# Altium schematic sheet lora.SchDoc
size A4; SheetNumber: 4; SheetTotal: 6
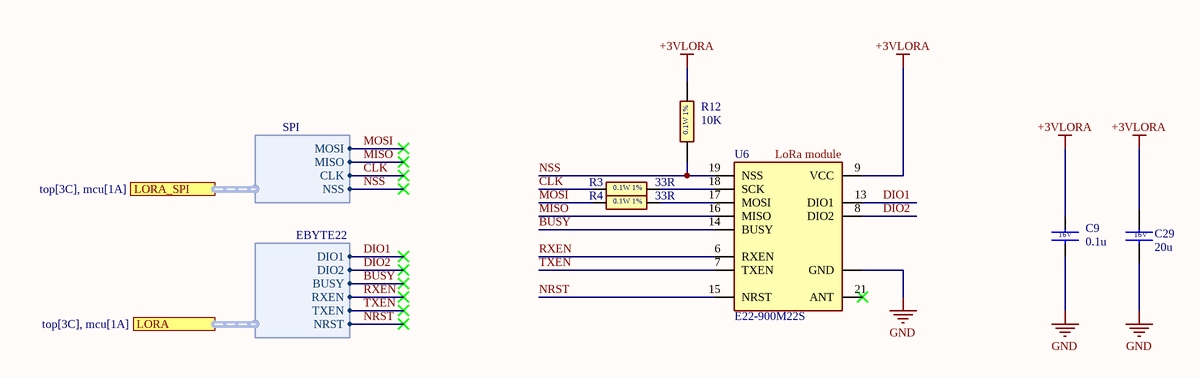
[diagram p0: lora.SchDoc]

## Parts
C9  0.1u  [CAPC1608X95N]
C29  20u  [C0603]
R3  33R  [RESC1608X55N]
R4  33R  [RESC1608X55N]
R12  10K  [RESC1608X50N]
U6  E22-900M22S  [E22-900M22S]

## Ports
LORA (harness EBYTE22, see top[3C], mcu[1A]), LORA_SPI (harness SPI, see top[3C], mcu[1A])

## Harnesses
SPI: MOSI, MISO, CLK, NSS
EBYTE22: BUSY, RXEN, TXEN, NRST, DIO2, DIO1

## Nets
+3VLORA: C9.1 C29.1 R12.2 U6.9(VCC)
GND: C9.2 C29.2 U6.1(GND)
BUSY: U6.14(BUSY) ; port LORA.BUSY
CLK: R3.1 ; port LORA_SPI.CLK
DIO1: U6.13(DIO1) ; port LORA.DIO1
DIO2: U6.8(DIO2) ; port LORA.DIO2
MISO: U6.16(MISO) ; port LORA_SPI.MISO
MOSI: R4.1 ; port LORA_SPI.MOSI
NRST: U6.15(NRST) ; port LORA.NRST
NSS: R12.1 U6.19(NSS) ; port LORA_SPI.NSS
RXEN: U6.6(RXEN) ; port LORA.RXEN
TXEN: U6.7(TXEN) ; port LORA.TXEN
NetR3_2: R3.2 U6.18(SCK)
NetR4_2: R4.2 U6.17(MOSI)

Not connected (* = marked no-connect by the designer): U6 21(ANT)*

## Notes on the sheet
- (near U6) LoRa module
- Název výkresu /drawing title/:
- Název souboru /sheet name/:
- Varianta /variant/:
- Organizace /organisation/:
- ČVUT FEL
- Kreslil /drawn by/:
- Datum /date/:
- Podpis /signature/:
- List /sheet/:
- Verze /version/:
- /
- (in symbol ECK+20u16V) 16V
- (in symbol ECK+100n16V) 16V
- (in symbol ER+10K) 0.1W 1%
- (in symbol ER+33R) 0.1W 1%

## Library data of the parts
C9 = ECK+100n16V: 16V 0.1uF XR7 0603 10%; Manufacturer_Name: KEMET; Manufacturer_Part_Number: C0603C104K4RAC-TU; Datasheet Link: https://connect.kemet.com:7667/gateway/IntelliData-ComponentDocumentation/1.0/download/specsheet/C0603C104K4RACTU; Height: 0.95mm; Mouser Part Number: 80-C0603C104K4RAC; Arrow Part Number: C0603C104K4RAC-TU; Arrow Price/Stock: https://www.arrow.com/en/products/c0603c104k4ractu/kemet-corporation
C29 = ECK+20u16V: Capacitor; Manufacturer_Name: Yageo Group; Manufacturer_Part_Number: C0603C200K4HACAUTO; Datasheet Link: https://www.yageogroup.com/content/datasheet/asset/file/KEM_C1007_X8R_ULTRA_150C_SMD; Height: 0.87mm; Mouser Part Number: 80-C0603C200K4HAUTO; Mouser Price/Stock: https://www.mouser.co.uk/ProductDetail/KEMET/C0603C200K4HACAUTO?qs=j%252B1pi9TdxUZOUXgrptGPiw%3D%3D; Arrow Part Number: C0603C200K4HACAUTO; Arrow Price/Stock: https://www.arrow.com/en/products/c0603c200k4hacauto/kemet-corporation?utm_currency=USD&region=nac
R3 R4 = ER+33R: Resistor 1% 0.1W; Manufacturer_Name: ROYALOHM; Manufacturer_Part_Number: 0603WAF330JT5E; Datasheet Link: https://datasheet.lcsc.com/lcsc/2206010116_UNI-ROYAL-Uniroyal-Elec-0603WAF330JT5E_C23140.pdf; Height: 0.55mm; Mouser Part Number: 303-0603WAF330JT5E; Mouser Price/Stock: https://www.mouser.co.uk/ProductDetail/Royalohm/0603WAF330JT5E?qs=e8oIoAS2J1RitKiKgULsBA%3D%3D
R12 = ER+10K: Resistor 1%, 0.1W; Manufacturer_Name: Vishay; Manufacturer_Part_Number: CRCW060310K0FKEA; Datasheet Link: http://www.vishay.com/docs/20035/dcrcwe3.pdf; Height: 0.5mm; Mouser Part Number: 71-CRCW0603-10K-E3; Mouser Price/Stock: https://www.mouser.co.uk/ProductDetail/Vishay-Dale/CRCW060310K0FKEA?qs=pAO1Z172M84BVnhDjtnsoQ%3D%3D; Arrow Part Number: CRCW060310K0FKEA; Arrow Price/Stock: https://www.arrow.com/en/products/crcw060310k0fkea/vishay?region=europe
U6 = EMCU+E22-900M22S: -147dBm 22.3dBm 7km SPI SMD,14x20mm LoRa Modules ROHS; pin to pad: 1>1+2+3+4+5+10+11+12+20+22